# Altium schematic sheet ScienceReceiverBoard.SchDoc: SPEXTRO - Science Receiver Board
size A4; Engineer: Matthew Glazer; Organization: RIT SPEX; Address1: Matthew Glazer; Revision: 2A; SheetNumber: 1; SheetTotal: 1
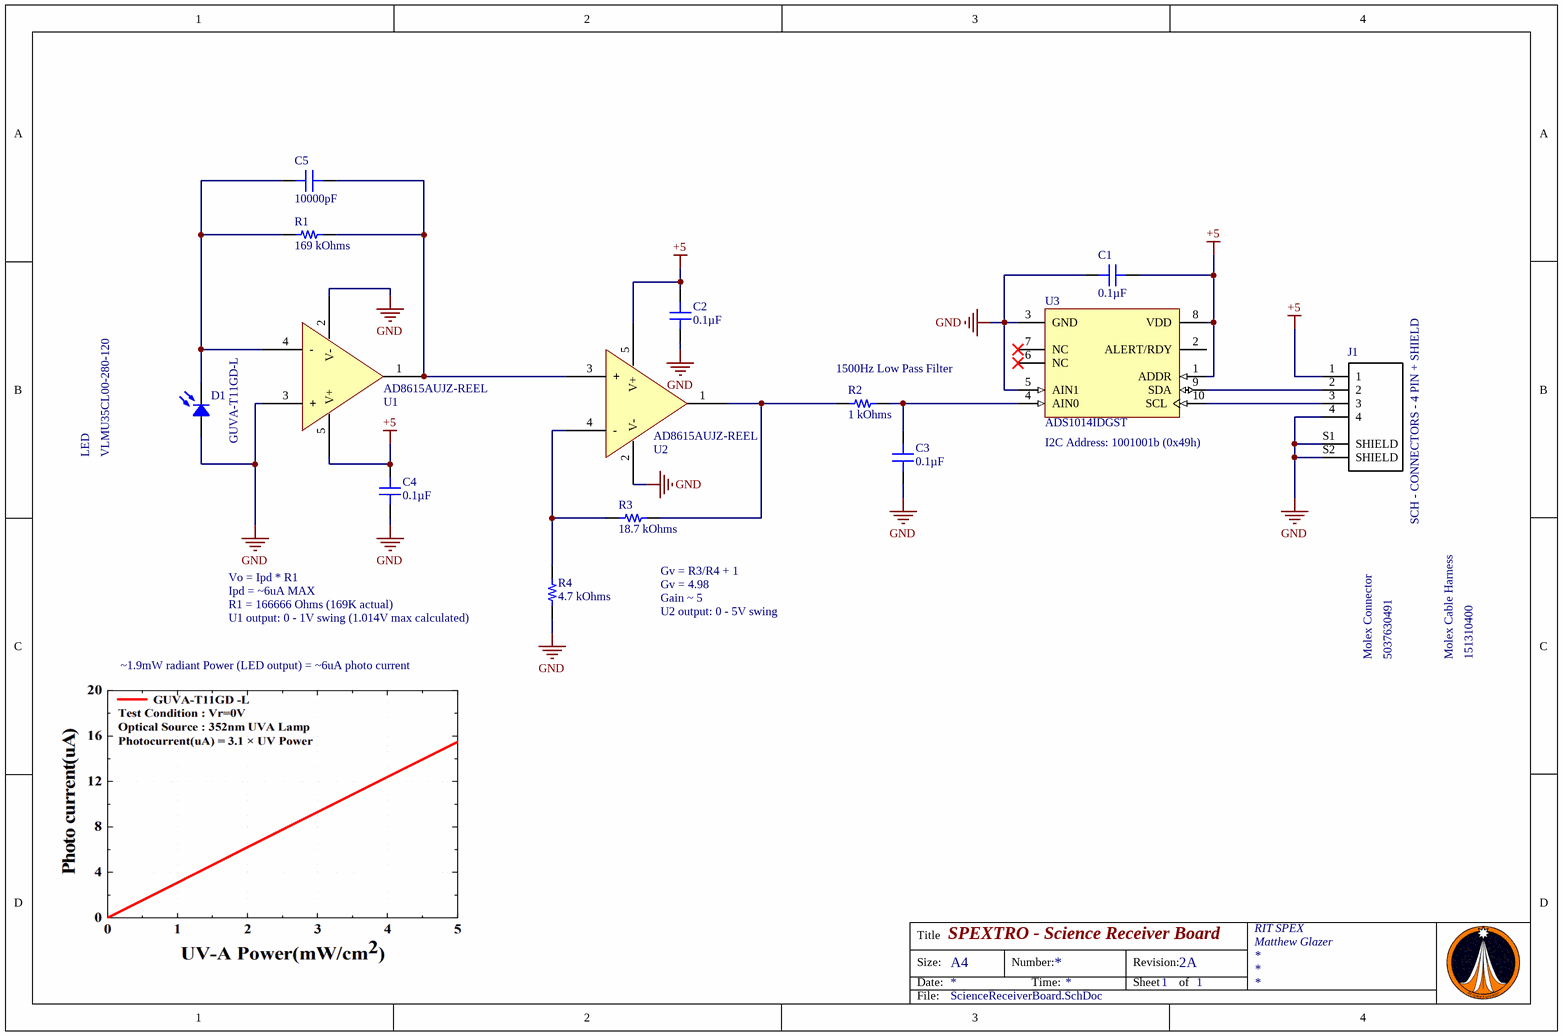
[diagram p0: ScienceReceiverBoard.SchDoc]

## Parts
C1  0.1µF  [CAP 0603_1608]
C2  0.1µF  [CAP 0603_1608]
C3  0.1µF  [CAP 0603_1608]
C4  0.1µF  [CAP 0603_1608]
C5  10000pF  [CAP 0603_1608]
D1  GUVA-T11GD-L  [Genicom TO-46-2]
J1  SCH - CONNECTORS - 4 PIN + SHIELD  [PCB - CONNECTOR - MOLEX - PICO-LOCK 5037630491]
R1  169 kOhms  [RES 0603_1608]
R2  1 kOhms  [RES 0603_1608]
R3  18.7 kOhms  [RES 0603_1608]
R4  4.7 kOhms  [RES 0603_1608]
U1  AD8615AUJZ-REEL  [ANALOG TSOT-23-5 UJ-5]
U2  AD8615AUJZ-REEL  [ANALOG TSOT-23-5 UJ-5]
U3  ADS1014IDGST  [TI-DGS10_L]

## Nets
+5: C1.2 C2.2 C4.2 J1.1 U1.5(V+) U2.5(V+) U3.1(ADDR) U3.8(VDD)
GND: C1.1 C2.1 C3.1 C4.1 D1.1 J1.4 J1.S1(SHIELD) J1.S2(SHIELD) R4.1 U1.2(V-) U1.3(+) U2.2(V-) U3.3(GND) U3.5(AIN1)
NetC3_2: C3.2 R2.2 U3.4(AIN0)
NetC5_1: C5.1 D1.2 R1.1 U1.4(-)
NetC5_2: C5.2 R1.2 U1.1(OUT) U2.3(+)
NetJ1_2: J1.2 U3.9(SDA)
NetJ1_3: J1.3 U3.10(SCL)
NetR2_1: R2.1 R3.2 U2.1(OUT)
NetR3_1: R3.1 R4.2 U2.4(-)

Not connected (* = marked no-connect by the designer): U3 2(ALERT/RDY) 6(NC)* 7(NC)*

## Notes on the sheet
- (near R2) 1500Hz Low Pass Filter
- (near U3) I2C Address: 1001001b (0x49h)
- LED
- VLMU35CL00-280-120
- Vo = Ipd * R1
- (near R3) Gv = R3/R4 + 1
- Ipd = ~6uA MAX
- (near R4) U1 output: 0 - 1V swing (1.014V max calculated)
- R1 = 166666 Ohms (169K actual)
- Gv = 4.98
- Gain ~ 5
- U2 output: 0 - 5V swing
- Molex Connector
- 5037630491
- Molex Cable Harness
- 151310400
- ~1.9mW radiant Power (LED output) = ~6uA photo current
- Title
- Size:
- Date:
- A4
- Number:
- Time:
- Revision:
- Sheet
- of
- File:

## Library data of the parts
C1-C4 = CC0603JRX7R7BB104: CAP CER 0.1UF 16V X7R 0603; Manufacturer: Yageo; Tolerance: ±5%; Part Number: CC0603JRX7R7BB104; Value: 0.1µF; Applications: General Purpose; Capacitance: 0.1µF; ComponentLink1Description: Datasheet; ComponentLink1URL: https://www.yageo.com/upload/media/product/productsearch/datasheet/mlcc/UPY-GPHC_X7R_6.3V-to-50V_18.pdf; ComponentLink2Description: DigiKey Link; ComponentLink2URL: http://digikey.com/product-detail/en/yageo/CC0603JRX7R7BB104/311-1776-1-ND/5195678; Device Package: 0603 (1608 Metric); LastUpdated: 1/21/2020 12:02:05 AM; Lifecycle Status: Active; Minimum Order: 1; Mounting Type: Surface Mount, MLCC; Operating Temperature: -55°C ~ 125°C; Package / Case: 0603 (1608 Metric); Packaging: TapeAndReel; PartId: 5272; Part Status: Active; Price: 0.01; Series: CC; Size / Dimension: 0.063" L x 0.031" W (1.60mm x 0.80mm); Supplier 1: DigiKey; Supplier Part Number 1: 311-1776-1-ND; Temperature Coefficient: X7R; Thickness (Max): 0.035" (0.90mm); Voltage - Rated: 16V
C5 = EMK107SD103JA-T: CAP CER 10000PF 16V 0603; Manufacturer: Taiyo Yuden; Tolerance: ±5%; Part Number: EMK107SD103JA-T; Value: 10000pF; Applications: RF, Microwave, High Frequency; Capacitance: 10000pF; ComponentLink1Description: Datasheet; ComponentLink1URL: http://www.yuden.co.jp/productdata/catalog/mlcc07_e.pdf; ComponentLink2Description: DigiKey Link; ComponentLink2URL: http://digikey.com/product-detail/en/taiyo-yuden/EMK107SD103JA-T/587-1093-1-ND/930870; Device Package: 0603 (1608 Metric); Features: Low Distortion; LastUpdated: 1/21/2020 12:01:57 AM; Lifecycle Status: Active; Minimum Order: 1; Mounting Type: Surface Mount, MLCC; Operating Temperature: -55°C ~ 125°C; Package / Case: 0603 (1608 Metric); Packaging: TapeAndReel; PartId: 10137; Part Status: Active; Price: 0.07; Series: CFCAP™; Size / Dimension: 0.063" L x 0.031" W (1.60mm x 0.80mm); Supplier 1: DigiKey; Supplier Part Number 1: 587-1093-1-ND; Thickness (Max): 0.035" (0.90mm); Voltage - Rated: 16V
D1 = PHOTODIODE: Part Number: GUVA-T11GD-L
J1 = SCH - CONNECTORS - 4 PIN + SHIELD: Connector Header Surface Mount, Right Angle 4 position 0.039 _1.00mm_; MF: Molex; MP: 5037630491; SnapEDA_Link: https://www.snapeda.com/parts/5037630491/Molex/view-part/3215405/?ref=snap; Package: None; Price: None; Availability: Unavailable; Value: *
R1 = RMCF0603FT169K: RES 169K OHM 1% 1/10W 0603; Manufacturer: Stackpole Electronics Inc; Power (Watts): 0.1W, 1/10W; Temperature Coefficient: ±100ppm/°C; Part Number: RMCF0603FT169K; Value: 169 kOhms; ComponentLink1Description: Datasheet; ComponentLink1URL: https://www.seielect.com/catalog/sei-rmcf_rmcp.pdf; ComponentLink2Description: DigiKey Link; ComponentLink2URL: http://digikey.com/product-detail/en/stackpole-electronics-inc/RMCF0603FT169K/RMCF0603FT169KCT-ND/2417939; Composition: Thick Film; Device Package: 0603 (1608 Metric); Features: Automotive AEC-Q200; Height - Seated (Max): 0.022" (0.55mm); LastUpdated: 1/21/2020 12:20:18 AM; Lifecycle Status: Active; Minimum Order: 1; Number of Terminations: 2; Operating Temperature: -55°C ~ 155°C; Package / Case: 0603 (1608 Metric); Packaging: CutTape; PartId: 16369; Part Status: Active; Price: 0.10; Ratings: AEC-Q200; Resistance: 169 kOhms; Series: RMCF; Size / Dimension: 0.061" L x 0.031" W (1.55mm x 0.80mm); Supplier 1: DigiKey; Supplier Part Number 1: RMCF0603FT169KCT-ND; Supplier Device Package: 0603; Tolerance: ±1%
R2 = RNCP0603FTD1K00: RES 1K OHM 1% 1/8W 0603; Manufacturer: Stackpole Electronics Inc; Power (Watts): 0.125W, 1/8W; Temperature Coefficient: ±100ppm/°C; Part Number: RNCP0603FTD1K00; Value: 1 kOhms; ComponentLink1Description: Datasheet; ComponentLink1URL: https://www.seielect.com/catalog/sei-rncp.pdf; ComponentLink2Description: DigiKey Link; ComponentLink2URL: http://digikey.com/product-detail/en/stackpole-electronics-inc/RNCP0603FTD1K00/RNCP0603FTD1K00CT-ND/2240445; Composition: Thin Film; Device Package: 0603 (1608 Metric); Features: Anti-Sulfur, Moisture Resistant; Height - Seated (Max): 0.020" (0.50mm); LastUpdated: 1/21/2020 12:24:38 AM; Lifecycle Status: Active; Minimum Order: 1; Number of Terminations: 2; Operating Temperature: -55°C ~ 155°C; Package / Case: 0603 (1608 Metric); Packaging: TapeAndReel; PartId: 5694; Part Status: Active; Price: 0.01; Resistance: 1 kOhms; Series: RNCP; Size / Dimension: 0.059" L x 0.031" W (1.50mm x 0.80mm); Supplier 1: DigiKey; Supplier Part Number 1: RNCP0603FTD1K00CT-ND; Supplier Device Package: 0603; Tolerance: ±1%
R3 = RMCF0603FT18K7: RES 18.7K OHM 1% 1/10W 0603; Manufacturer: Stackpole Electronics Inc; Power (Watts): 0.1W, 1/10W; Temperature Coefficient: ±100ppm/°C; Part Number: RMCF0603FT18K7; Value: 18.7 kOhms; ComponentLink1Description: Datasheet; ComponentLink1URL: https://www.seielect.com/catalog/sei-rmcf_rmcp.pdf; ComponentLink2Description: DigiKey Link; ComponentLink2URL: http://digikey.com/product-detail/en/stackpole-electronics-inc/RMCF0603FT18K7/RMCF0603FT18K7CT-ND/2417955; Composition: Thick Film; Device Package: 0603 (1608 Metric); Features: Automotive AEC-Q200; Height - Seated (Max): 0.022" (0.55mm); LastUpdated: 1/21/2020 12:20:29 AM; Lifecycle Status: Active; Minimum Order: 1; Number of Terminations: 2; Operating Temperature: -55°C ~ 155°C; Package / Case: 0603 (1608 Metric); Packaging: CutTape; PartId: 16008; Part Status: Active; Price: 0.10; Ratings: AEC-Q200; Resistance: 18.7 kOhms; Series: RMCF; Size / Dimension: 0.061" L x 0.031" W (1.55mm x 0.80mm); Supplier 1: DigiKey; Supplier Part Number 1: RMCF0603FT18K7CT-ND; Supplier Device Package: 0603; Tolerance: ±1%
R4 = RMCF0603FT4K70: RES 4.7K OHM 1% 1/10W 0603; Manufacturer: Stackpole Electronics Inc; Power (Watts): 0.1W, 1/10W; Temperature Coefficient: ±100ppm/°C; Part Number: RMCF0603FT4K70; Value: 4.7 kOhms; ComponentLink1Description: Datasheet; ComponentLink1URL: https://www.seielect.com/catalog/sei-rmcf_rmcp.pdf; ComponentLink2Description: DigiKey Link; ComponentLink2URL: http://digikey.com/product-detail/en/stackpole-electronics-inc/RMCF0603FT4K70/RMCF0603FT4K70CT-ND/1943033; Composition: Thick Film; Device Package: 0603 (1608 Metric); Features: Automotive AEC-Q200; Height - Seated (Max): 0.022" (0.55mm); LastUpdated: 1/21/2020 12:24:32 AM; Lifecycle Status: Active; Minimum Order: 1; Number of Terminations: 2; Operating Temperature: -55°C ~ 155°C; Package / Case: 0603 (1608 Metric); Packaging: CutTape; PartId: 6078; Part Status: Active; Price: 0.10; Ratings: AEC-Q200; Resistance: 4.7 kOhms; Series: RMCF; Size / Dimension: 0.061" L x 0.031" W (1.55mm x 0.80mm); Supplier 1: DigiKey; Supplier Part Number 1: RMCF0603FT4K70CT-ND; Supplier Device Package: 0603; Tolerance: ±1%
U1 U2 = AD8615AUJZ-REEL: IC OPAMP GP 1 CIRCUIT TSOT23-5; Manufacturer: Analog Devices Inc.; Amplifier Type: General Purpose; Current - Input Bias: 0.2pA; Current - Output / Channel: 150mA; Current - Supply: 1.7mA; Gain Bandwidth Product: 24MHz; Number of Circuits: 1; Output Type: Rail-to-Rail; Slew Rate: 12V/µs; Voltage - Input Offset: 23µV; Voltage - Supply, Single/Dual (±): 2.7V ~ 5.5V, ±1.35V ~ 2.75V; Part Number: AD8615AUJZ-REEL; ComponentLink1Description: Datasheet; ComponentLink1URL: https://www.analog.com/media/en/technical-documentation/data-sheets/AD8615_8616_8618.pdf; ComponentLink2Description: DigiKey Link; ComponentLink2URL: //digikey.com/product-detail/en/analog-devices-inc/AD8615AUJZ-REEL/AD8615AUJZ-REELTR-ND/993826; Device Package: SOT-23-5 Thin, TSOT-23-5; LastUpdated: 12/9/2019 2:06:44 AM; Lifecycle Status: 0; Minimum Order: 1; Mounting Type: Surface Mount; Operating Temperature: -40°C ~ 125°C; Package / Case: SOT-23-5 Thin, TSOT-23-5; Packaging: TapeAndReel; PartId: 5; Part Status: Active; Price: 1.06; Series: DigiTrim®; Supplier 1: DigiKey; Supplier Part Number 1: AD8615AUJZ-REELTR-ND; Supplier Device Package: TSOT-23-5
U3 = CMP-0003-00375-2: 12-Bit ADC with Integrated PGA, Comparator, Oscillator, and Reference, -40 to 125 degC, 10-pin SOP (DGS10), Green (RoHS & no Sb/Br); Manufacturer: Texas Instruments; INL(Max)(+/-LSB): 0.5; # Input Channels: 1; Digital Supply(Max)(V): 5.5; Architecture: Delta-Sigma; Interface: Serial I2C; Digital Supply(Min)(V): 2; Sample Rate (max)(SPS): 3.3k; Resolution(Bits): 12; SubFamily: Precision ADC (<=10MSPS); DatasheetVersion: SBAS473C; PackageVersion: 4073272/C, 02/2004; PackageDescription: 10-Pin Plastic Small Outline, Body 3 x 3 mm, Pitch 0.5 mm; Eco-Plan: Green (RoHS & no Sb/Br); Code_JEDEC: MO-153; ComponentLink1Description: Manufacturer URL; ComponentLink1URL: http://www.ti.com/; Analog Voltage AV/DD(Max)(V): 5.5; ComponentLink2URL: http://www.ti.com/general/docs/lit/getliterature.tsp?genericPartNumber=ADS1014&fileType=pdf; PackageReference: DGS10; PartNumber: ADS1014IDGST; ComponentLink3URL: http://www.ti.com/lit/ml/mpds035b/mpds035b.pdf; ComponentLink2Description: Datasheet; ComponentLink3Description: Package Specification; Analog Voltage AV/DD(Min)(V): 2; Mounting Technology: Surface Mount